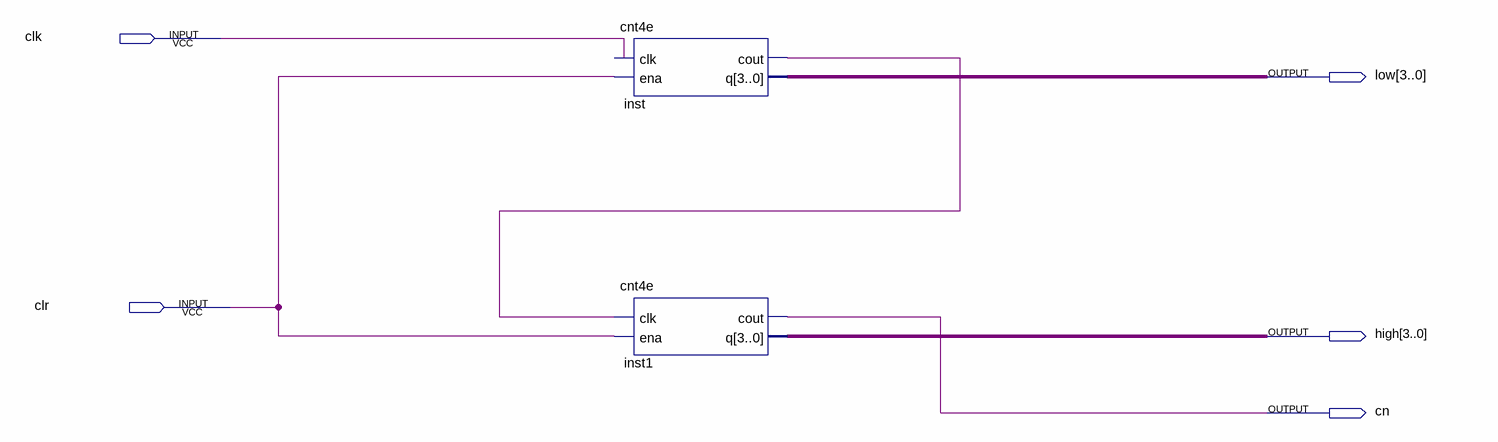
[diagram p0: schematic sheet]
// Quartus schematic bcd_couter.bdf as structural Verilog: 2 symbols, 5 pins
module bcd_couter (
  input  clk,
  input  clr,
  output [3:0] low,
  output [3:0] high,
  output cn
);

  wire inst_cout;

  cnt4e inst (.ena(clr), .cout(inst_cout), .q(low));  // open: clk
  cnt4e inst1 (.clk(inst_cout), .ena(clr), .cout(cn), .q(high));
endmodule
